# Altium schematic sheet Cover Page.SchDoc
size 420 x 297 mm; Date: 28.05.2024; ApprovedBy: Arda B.; CheckedBy: Arda B.; DrawnBy: Arda Bozkurt; Revision: 001; SheetNumber: 1; SheetTotal: 5; Department: HDD; Size: A3; Time: 28.05.2024
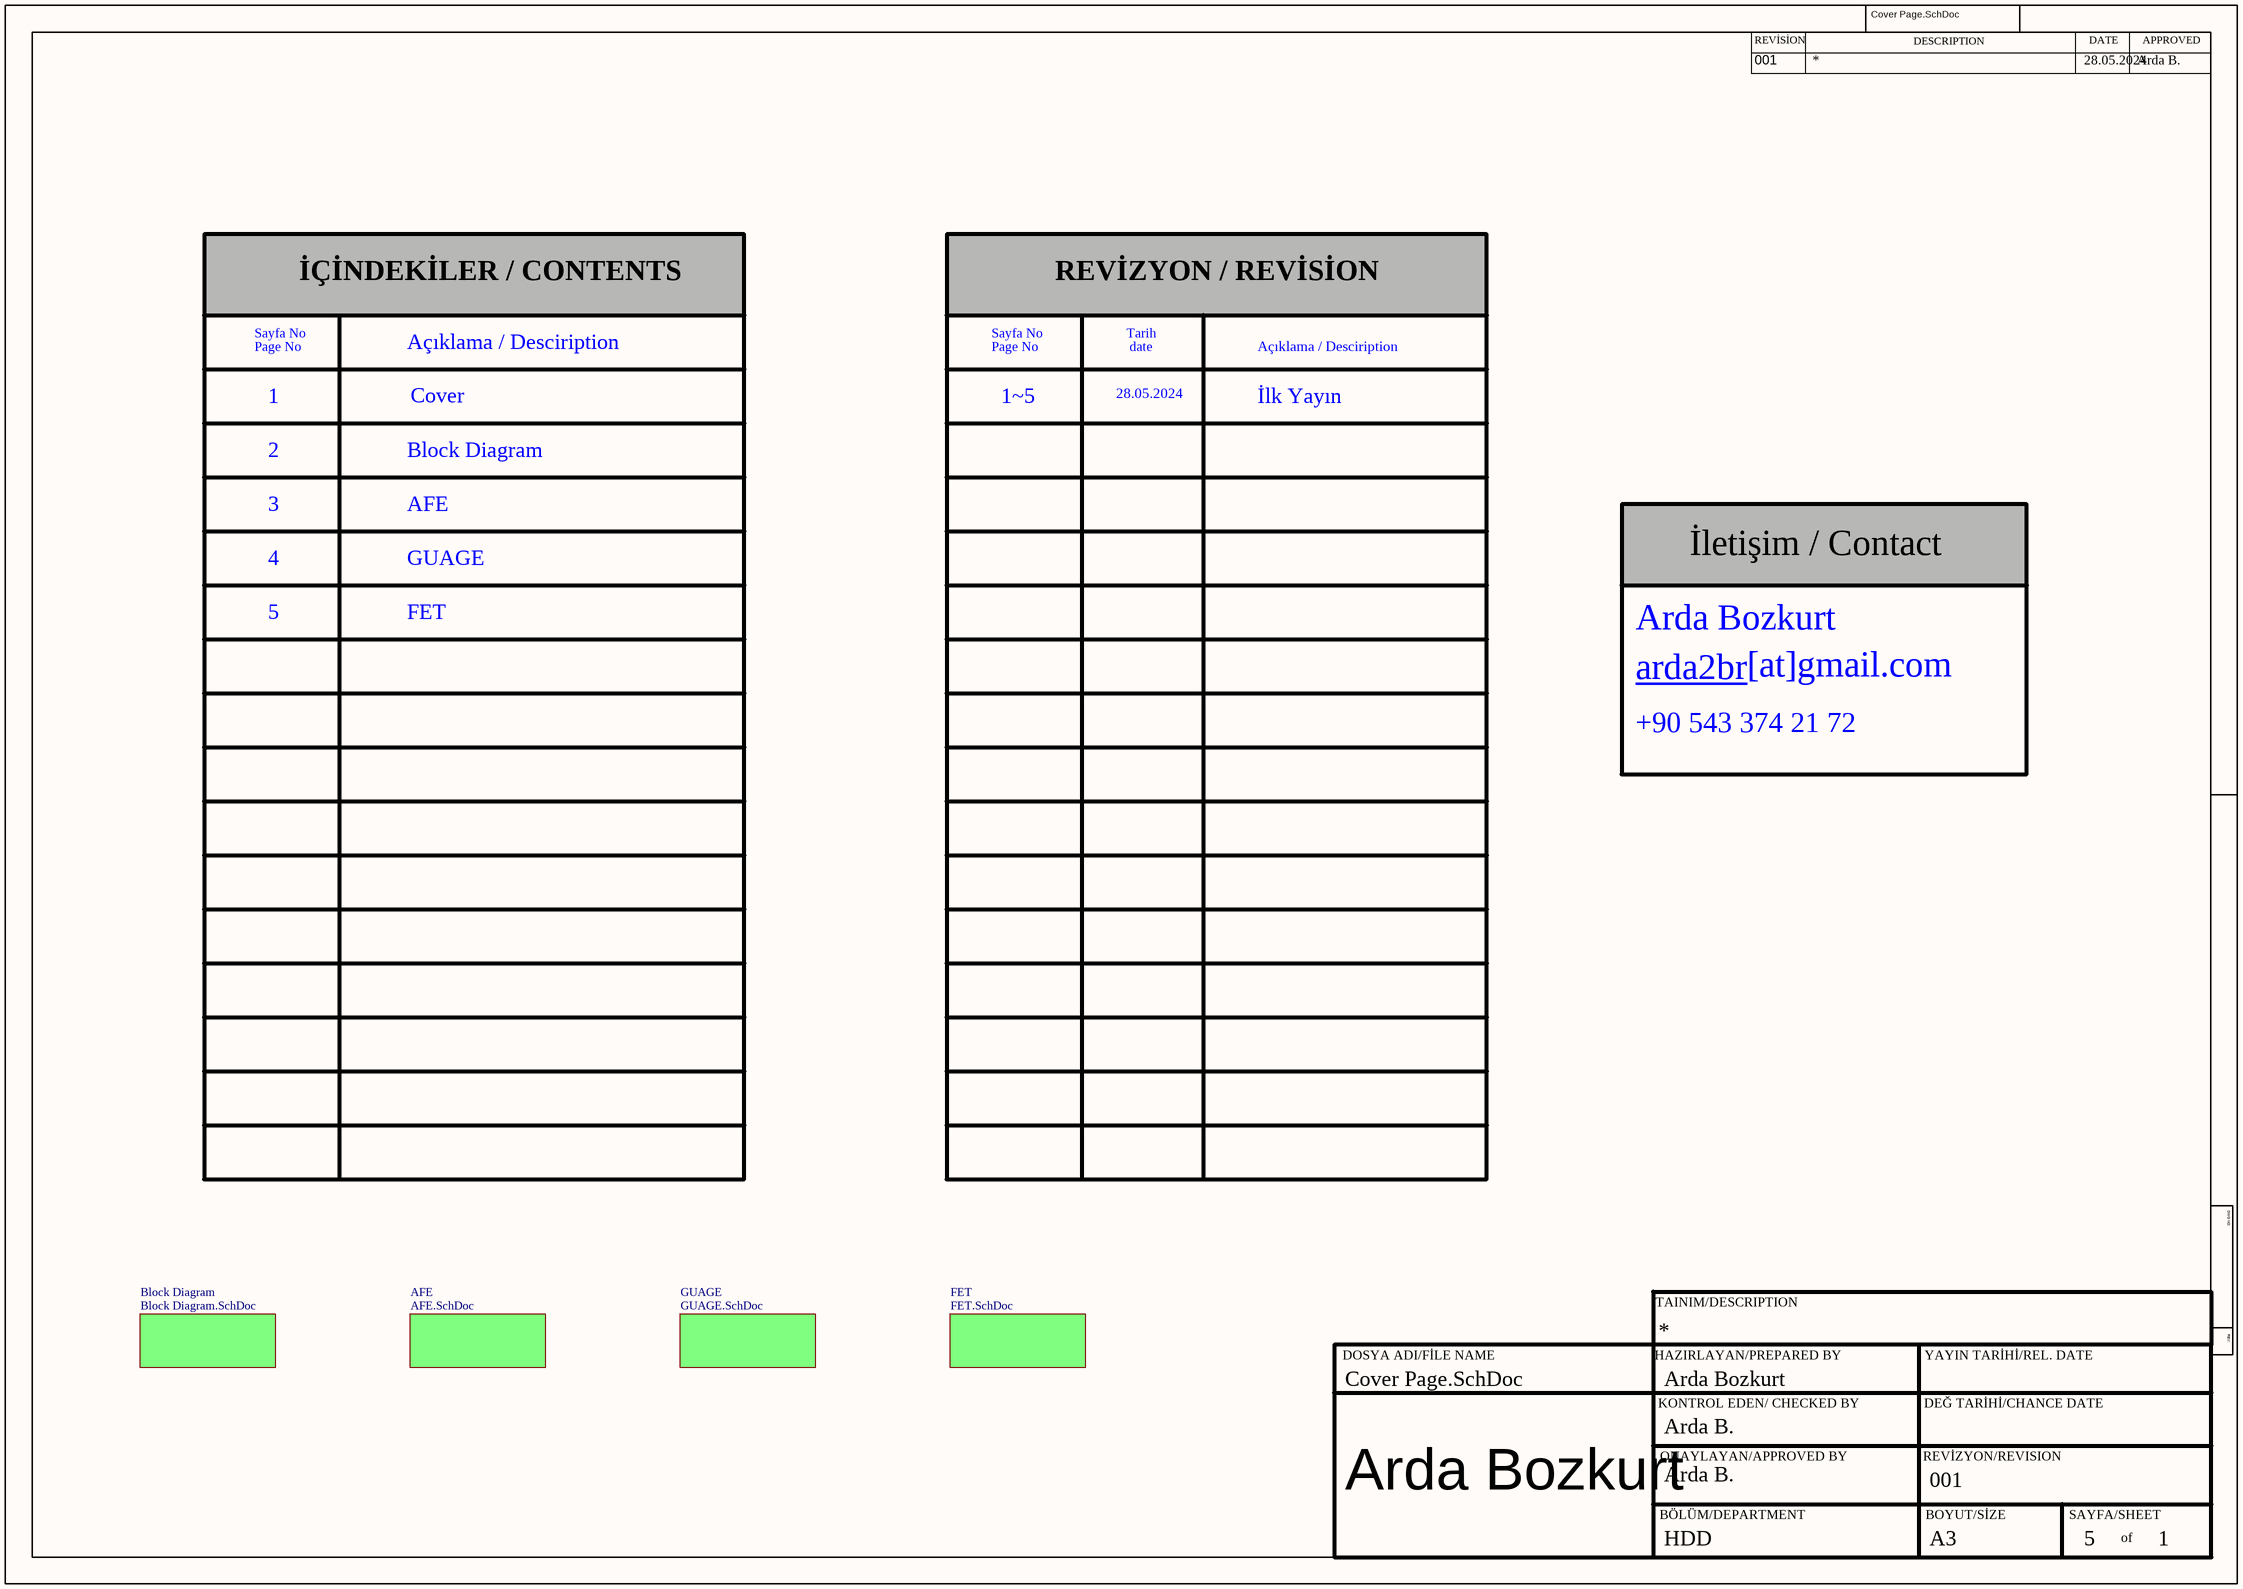
[diagram p0: Cover Page.SchDoc]

## Sub-sheets
AFE = AFE.SchDoc: no entries
Block Diagram = Block Diagram.SchDoc: no entries
FET  = FET.SchDoc: no entries
GUAGE = GUAGE.SchDoc: no entries

## Notes on the sheet
- İÇİNDEKİLER / CONTENTS
- REVİZYON / REVİSİON
- Page No
- Sayfa No
- Açıklama / Desciription
- Tarih
- date
- 1
- 2
- Block Diagram
- Cover
- 1~5
- 28.05.2024
- İlk Yayın
- 3
- AFE
- 4
- GUAGE
- İletişim / Contact
- 5
- FET
- Arda Bozkurt
- arda2br
- [at]gmail.com
- +90 543 374 21 72
- REVİSİON
- DESCRIPTION
- DATE
- APPROVED
- DWG NO:
- TAINIM/DESCRIPTION
- REV:
- DOSYA ADI/FİLE NAME
- HAZIRLAYAN/PREPARED BY
- KONTROL EDEN/ CHECKED BY
- YAYIN TARİHİ/REL. DATE
- DEĞ TARİHİ/CHANCE DATE
- ONAYLAYAN/APPROVED BY
- REVİZYON/REVISION
- BÖLÜM/DEPARTMENT
- BOYUT/SİZE
- SAYFA/SHEET
- of